# EAGLE design pulse sensor (EAGLE 7.0.0)
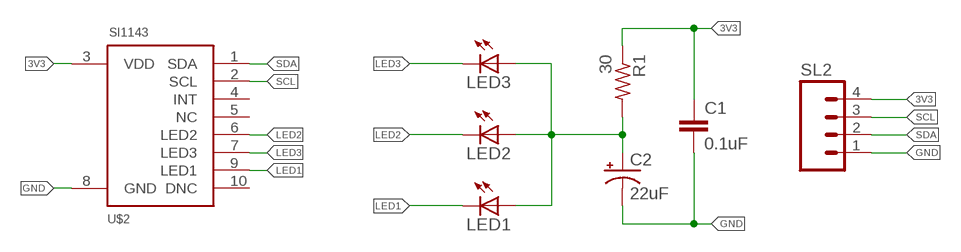
[diagram p0: schematic, sheet 1]

## Parts
C1  0.1uF  .1UF-CER  [0402-CAP]
C2  22uF  CAP_POL1206  [EIA3216]
LED1  LED1206  [LED-1206]
LED2  LED1206  [LED-1206]
LED3  LED1206  [LED-1206]
R1  30  R-US_R0402  [R0402]
SL2  M04SMD  [1X04-SMD]
U$2  SI1143  [SI1143]

## Nets
3V3: C1.1 R1.1 SL2.4 U$2.3(VDD)
GND: C1.2 C2.C(-) SL2.1 U$2.8(GND)
LED1: LED1.C U$2.9(LED1)
LED2: LED2.C U$2.6(LED2)
LED3: LED3.C U$2.7(LED3)
N$2: C2.A(+) LED1.A LED2.A LED3.A R1.2
SCL: SL2.3 U$2.2(SCL)
SDA: SL2.2 U$2.1(SDA)
Unconnected: U$2.4(INT) U$2.5(NC) U$2.10(DNC)

## Library data of the parts
C1 = SparkFun-Capacitors:.1UF-CER: .1uF ceramic SMT CAP-00810- 25V +80%/-20% (0603) CAP-08390- 100V 10% (0603) CAP-08604- 25V 5% (0603); PROD_ID: CAP-00810
C2 = SparkFun-Passives:CAP_POL: Capacitor Polarized These are standard SMD and PTH capacitors. Normally 10uF, 47uF, and 100uF in electrolytic and tantalum varieties. Always verify the external diameter of the through hole cap, it varies with capacity, voltage, and manufacturer. The EIA devices should be standard.
LED1-LED3 = SparkFun-LED:LED: LEDs Standard schematic elements and footprints for 5mm, 3mm, 1206, and 0603 sized LEDs. 5mm - Spark Fun Electronics SKU : COM-00529 (and others)
R1 = resistor:R-US_: RESISTOR, American symbol
SL2 = SparkFun-Connectors:M04: Header 4 Standard 4-pin 0.1" header. Use with straight break away headers (SKU : PRT-00116), right angle break away headers (PRT-00553), swiss pins (PRT-00743), machine pins (PRT-00117), and female headers (PRT-00115). Molex polarized connector foot print use with SKU : PRT-08231 with associated crimp pins and housings. 1MM SMD Version SKU: PRT-10208
U$2 = pulse:SI1143

## Board
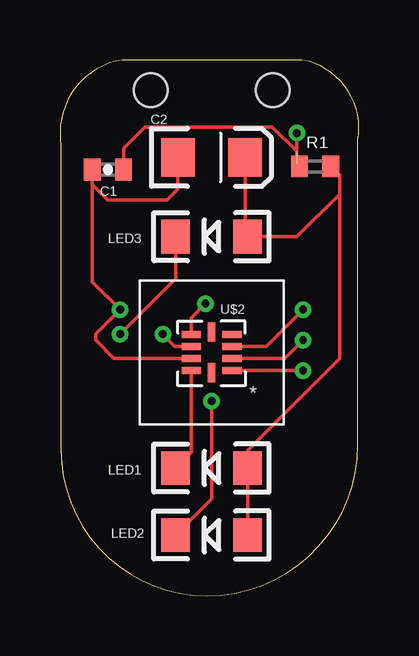
[diagram p1: board, top side]
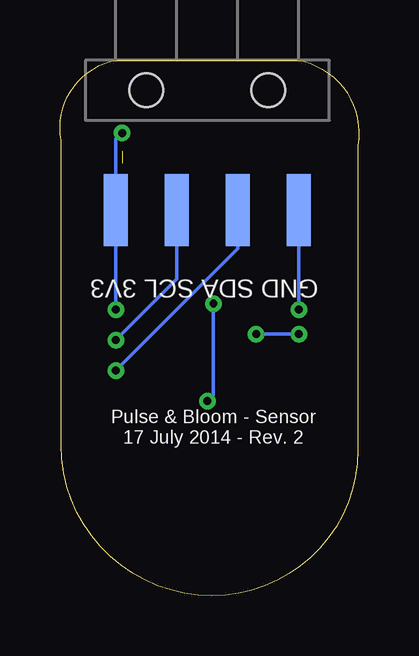
[diagram p2: board, bottom side, seen from below]

Size 12.46 x 22.34 mm. Coordinates in mm from the lower left corner, seen from the top.
Outline: 12.41,6.29 12.41,18.99 arc90 10.08,22.34 2.59,22.34 arc90 0.04,18.78 0.04,6.08 arc90 6.12,0 arc90 12.41,6.29
Copper layers (1*16): Top 0.0356mm / dielectric 1.5011mm / Bottom 0.0356mm
Design rules "OSHPark": minimum track width 6mil, minimum drill 13mil, track to track 6mil, track to pad 6mil, pad to pad 6mil, via to via 6mil, smd to smd 6mil, copper to edge 15mil, drill to drill 6mil, minimum pad ring 7mil, minimum via ring 7mil, stop-mask expansion 3mil, vias tented up to drill 0mil, thermal gap 10mil

### Footprints (pad centres in the part's own frame; a part is rotated, then mirrored left to right if it is on the bottom)
0402-CAP = smd 0.7 x 0.9: 1 -0.65,0; 2 0.65,0
EIA3216 = smd 1.4 x 1.6: A 1.4,0; C -1.4,0
LED-1206 = smd 1.2 x 1.4: A -1.5,0; C 1.5,0
R0402 = smd 0.7 x 0.9: 1 -0.65,0; 2 0.65,0
1X04-SMD = smd 1 x 3: 1 -3.81,5; 2 -1.27,5; 3 1.27,5; 4 3.81,5 | hole 1.4: -2.54,0; 2.54,0
SI1143 = smd 0.8 x 0.3: 1 -0.85,0.75; 2 -0.85,0.25; 3 -0.85,-0.25; 4 -0.85,-0.75; 6 0.85,-0.75; 7 0.85,-0.25; 8 0.85,0.25; 9 0.85,0.75 | smd 0.3 x 0.8: 5 0,-0.85; 10 0,0.85

### Placement (x,y rotation side)
C1  2,17.77 180 top
C2  6.32,18.28 0 top
LED1  6.32,5.32 180 top
LED2  6.32,2.53 180 top
LED3  6.32,14.98 180 top
R1  10.63,17.9 0 top
SL2  6.32,21.07 180 bottom
U$2  6.32,10.15 180 top

### Tracks (layer width: path | path; a pad name or v marks a point on that pad's centre or on a via)
3V3  (via drill 0.33)  (1 unrouted)
  Top 0.152: U$2.3 8.6,10.4 v10.13,11.93 | C1.1 2.65,18.67 3.52,19.55 8.84,19.55 9.87,18.53 | 10,17.9 R1.1 | 9.87,18.04 R1.1 | R1.1 9.87,18.01 v9.87,19.29
  Bottom 0.152: v10.13,11.93 SL2.4 10.13,19.04 v9.87,19.29
GND  (via drill 0.33)
  Top 0.152: 1.35,17.15 2,16.5 4.45,16.5 4.92,16.97 C2.C | C1.2 1.35,17.15 | 1.35,17.15 1.35,13.09 v2.51,11.93 1.49,10.91 1.49,10.66 2.25,9.9 U$2.8
  Bottom 0.152: v2.51,11.93 SL2.1
LED1
  Top 0.152: U$2.9 5.47,5.97 LED1.C
LED2  (via drill 0.33)
  Top 0.152: U$2.6 5.47,11.59 v6.06,12.18 | v6.32,8.12 6.32,4.03 LED2.C
  Bottom 0.152: v6.06,12.18 6.06,8.37 v6.32,8.12
LED3  (via drill 0.33)
  Top 0.152: LED3.C 4.82,13.22 v2.51,10.91 | v4.28,10.91 4.79,10.4 U$2.7
  Bottom 0.152: v2.51,10.91 v4.28,10.91
N$2
  Top 0.152: LED2.A LED1.A 7.82,6.06 11.65,9.9 11.65,16.75 | 11.65,16.75 11.65,17.53 R1.2 | 7.42,15.37 LED3.A | 7.42,15.14 7.59,14.98 LED3.A | LED3.A 9.87,14.98 11.65,16.75 | C2.A 7.72,15.08 LED3.A
SCL  (via drill 0.33)
  Top 0.152: U$2.2 9.37,9.9 v10.13,10.66
  Bottom 0.152: v10.13,10.66 7.59,13.2 SL2.3
SDA  (via drill 0.33)
  Top 0.152: U$2.1 7.09,9.4 7.08,9.39 v10.13,9.39
  Bottom 0.152: v10.13,9.39 5.05,14.47 SL2.2

### Text on the board
bNames: GND SDA SCL 3V3 | Pulse & Bloom - Sensor / 17 July 2014 - Rev. 2